# Altium project EIT_Teensybasedv1.PrjPcb (part 1 of 3)
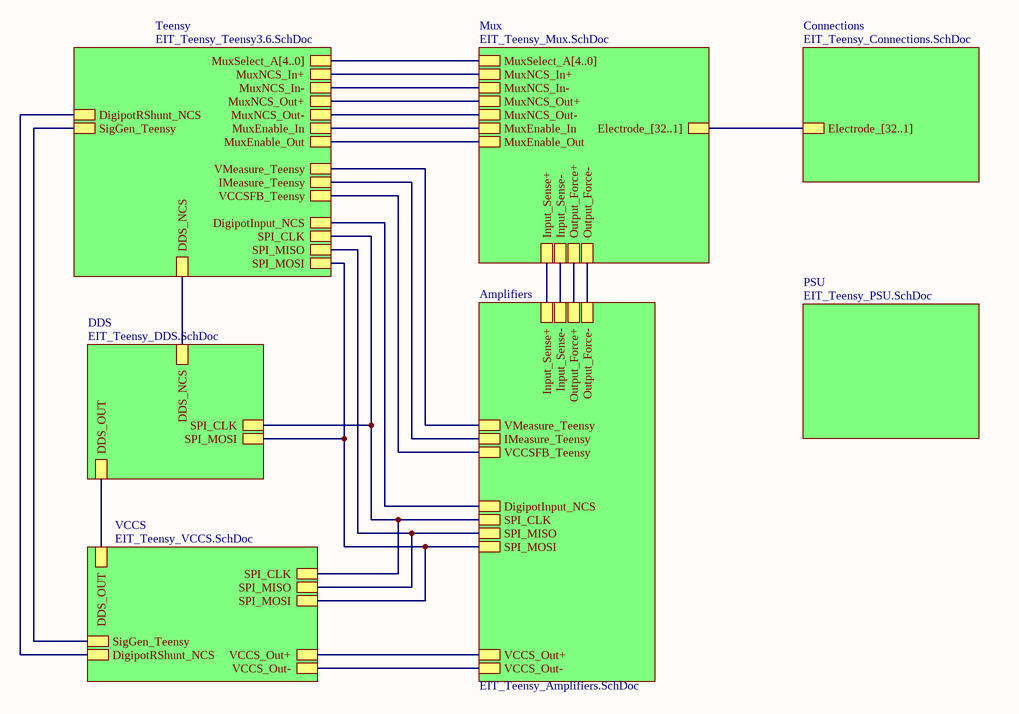
[diagram p0: EIT_Teensy.SchDoc]
Revision: 0.1; Title: EIT_Teensy
8 sheets, 118 parts. Net scope: hierarchical (ports join the sheet entries above them; power ports are global).
Board file: EIT_Teensy_PCBMain.PcbDoc
Sheets:
  EIT_Teensy.SchDoc
    Teensy = EIT_Teensy_Teensy3.6.SchDoc
    DDS = EIT_Teensy_DDS.SchDoc
    Connections = EIT_Teensy_Connections.SchDoc
    Mux = EIT_Teensy_Mux.SchDoc
    PSU = EIT_Teensy_PSU.SchDoc
    VCCS = EIT_Teensy_VCCS.SchDoc
    Amplifiers = EIT_Teensy_Amplifiers.SchDoc

## Sheet EIT_Teensy.SchDoc: EIT_Teensy
size A

### Sub-sheets
Amplifiers = EIT_Teensy_Amplifiers.SchDoc: IMeasure_Teensy, Input_Sense+, Input_Sense-, Output_Force+, Output_Force-, VCCS_Out+, VCCS_Out-, VMeasure_Teensy, VCCSFB_Teensy, DigipotInput_NCS, SPI_CLK, SPI_MISO, SPI_MOSI
Connections = EIT_Teensy_Connections.SchDoc: Electrode_[32..1]
DDS = EIT_Teensy_DDS.SchDoc: DDS_OUT, DDS_NCS, SPI_CLK, SPI_MOSI
Mux = EIT_Teensy_Mux.SchDoc: Electrode_[32..1], MuxSelect_A[4..0], Input_Sense+, Input_Sense-, Output_Force+, Output_Force-, MuxEnable_In, MuxEnable_Out, MuxNCS_In+, MuxNCS_In-, MuxNCS_Out+, MuxNCS_Out-
PSU = EIT_Teensy_PSU.SchDoc: no entries
Teensy = EIT_Teensy_Teensy3.6.SchDoc: MuxSelect_A[4..0], IMeasure_Teensy, VMeasure_Teensy, DDS_NCS, VCCSFB_Teensy, SigGen_Teensy, MuxEnable_In, MuxEnable_Out, DigipotRShunt_NCS, DigipotInput_NCS, SPI_CLK, SPI_MISO, SPI_MOSI, MuxNCS_In+, MuxNCS_In-, MuxNCS_Out+, MuxNCS_Out-
VCCS = EIT_Teensy_VCCS.SchDoc: DDS_OUT, VCCS_Out+, VCCS_Out-, SigGen_Teensy, DigipotRShunt_NCS, SPI_CLK, SPI_MISO, SPI_MOSI

### Nets
DDS_NCS: sheet Teensy/DDS_NCS, sheet DDS/DDS_NCS
DDS_OUT: sheet DDS/DDS_OUT, sheet VCCS/DDS_OUT
DigipotInput_NCS: sheet Teensy/DigipotInput_NCS, sheet Amplifiers/DigipotInput_NCS
DigipotRShunt_NCS: sheet Teensy/DigipotRShunt_NCS, sheet VCCS/DigipotRShunt_NCS
IMeasure_Teensy: sheet Teensy/IMeasure_Teensy, sheet Amplifiers/IMeasure_Teensy
Input_Sense+: sheet Mux/Input_Sense+, sheet Amplifiers/Input_Sense+
Input_Sense-: sheet Mux/Input_Sense-, sheet Amplifiers/Input_Sense-
MuxEnable_In: sheet Teensy/MuxEnable_In, sheet Mux/MuxEnable_In
MuxEnable_Out: sheet Teensy/MuxEnable_Out, sheet Mux/MuxEnable_Out
MuxNCS_In+: sheet Teensy/MuxNCS_In+, sheet Mux/MuxNCS_In+
MuxNCS_In-: sheet Teensy/MuxNCS_In-, sheet Mux/MuxNCS_In-
MuxNCS_Out+: sheet Teensy/MuxNCS_Out+, sheet Mux/MuxNCS_Out+
MuxNCS_Out-: sheet Teensy/MuxNCS_Out-, sheet Mux/MuxNCS_Out-
Output_Force+: sheet Mux/Output_Force+, sheet Amplifiers/Output_Force+
Output_Force-: sheet Mux/Output_Force-, sheet Amplifiers/Output_Force-
SigGen_Teensy: sheet Teensy/SigGen_Teensy, sheet VCCS/SigGen_Teensy
SPI_CLK: sheet Teensy/SPI_CLK, sheet DDS/SPI_CLK, sheet VCCS/SPI_CLK, sheet Amplifiers/SPI_CLK
SPI_MISO: sheet Teensy/SPI_MISO, sheet VCCS/SPI_MISO, sheet Amplifiers/SPI_MISO
SPI_MOSI: sheet Teensy/SPI_MOSI, sheet DDS/SPI_MOSI, sheet VCCS/SPI_MOSI, sheet Amplifiers/SPI_MOSI
VCCS_Out+: sheet VCCS/VCCS_Out+, sheet Amplifiers/VCCS_Out+
VCCS_Out-: sheet VCCS/VCCS_Out-, sheet Amplifiers/VCCS_Out-
VCCSFB_Teensy: sheet Teensy/VCCSFB_Teensy, sheet Amplifiers/VCCSFB_Teensy
VMeasure_Teensy: sheet Teensy/VMeasure_Teensy, sheet Amplifiers/VMeasure_Teensy

### Buses and harness runs
bus sheet Connections/Electrode_[32..1] = sheet Mux/Electrode_[32..1]
bus sheet Mux/MuxSelect_A[4..0] = sheet Teensy/MuxSelect_A[4..0]

## Sheet EIT_Teensy_Teensy3.6.SchDoc: EIT_Teensy
size A
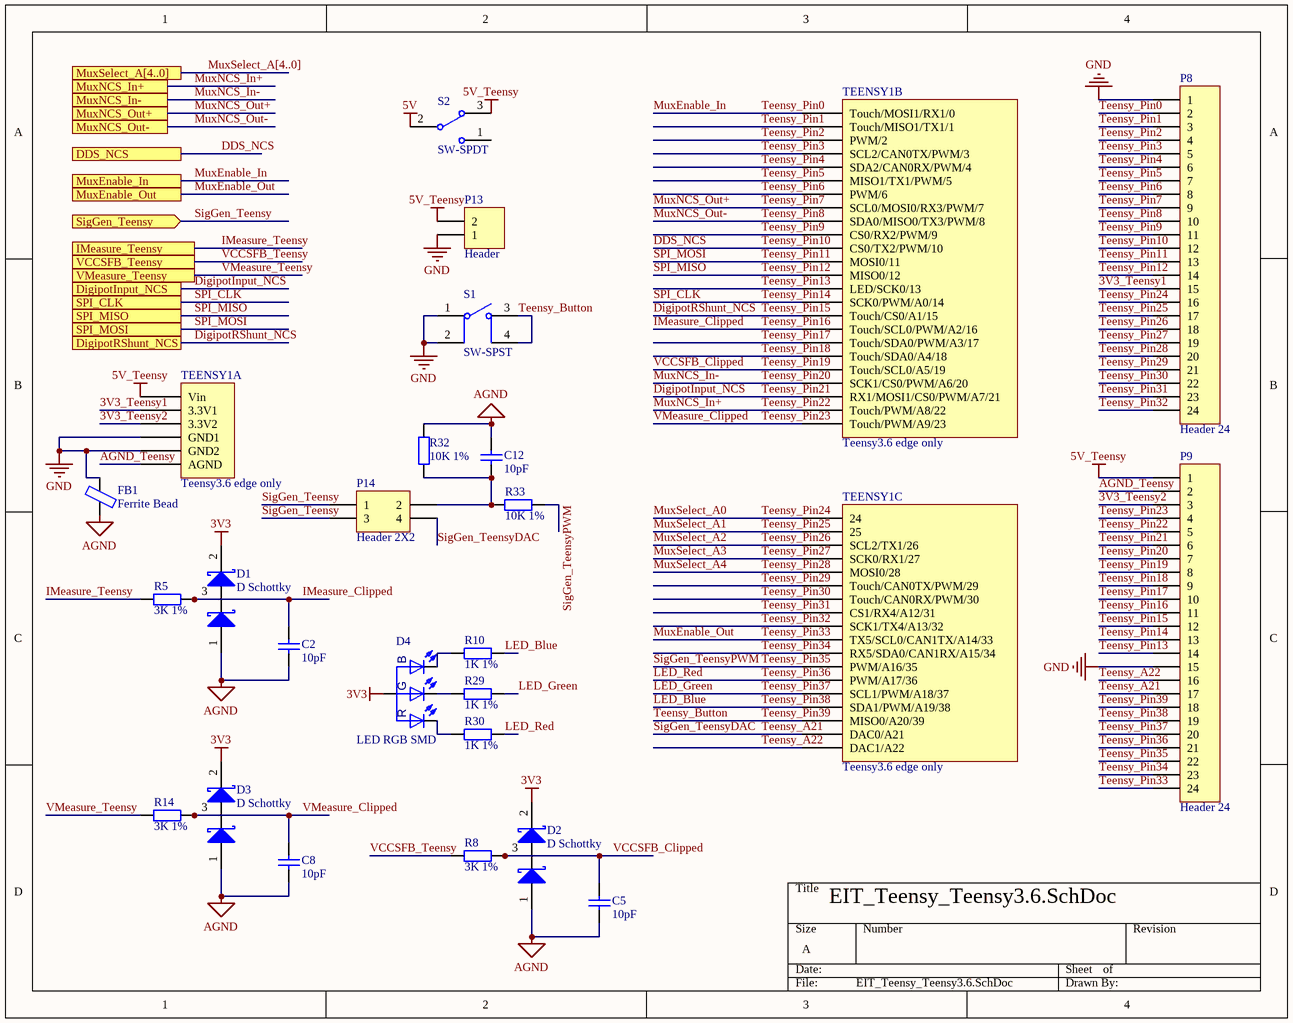
[diagram p1: EIT_Teensy_Teensy3.6.SchDoc]

### Parts
C2  10pF  [0603 CAP]
C5  10pF  [0603 CAP]
C8  10pF  [0603 CAP]
C12  10pF  [0603 CAP]
D1  D Schottky  [SOT-23_STM-M]
D2  D Schottky  [SOT-23_STM-M]
D3  D Schottky  [SOT-23_STM-M]
D4  LED RGB SMD  [LED_RGB]
FB1  Ferrite Bead  [0603 CAP]
P8  Header 24  [HDR1X24]
P9  Header 24  [HDR1X24]
P13  Header  [HEADER 2.54MM 2X1 MALE]
P14  Header 2X2  [HDR2X2 Male 2.54mm]
R5  3K 1%  [0603 RES]
R8  3K 1%  [0603 RES]
R10  1K 1%  [0603 RES]
R14  3K 1%  [0603 RES]
R29  1K 1%  [0603 RES]
R30  1K 1%  [0603 RES]
R32  10K 1%  [0603 RES]
R33  10K 1%  [0603 RES]
S1  SW-SPST  [Tactile Switch SMD MOM]
S2  SW-SPDT  [Switch Slide SPDT]
TEENSY1  Teensy3.6 edge only  [Teensy3.6-edgeonly]  (parts A,B,C of 3)

### Ports
DDS_NCS, DigipotInput_NCS, DigipotRShunt_NCS, IMeasure_Teensy, MuxEnable_In, MuxEnable_Out, MuxNCS_In+, MuxNCS_In-, MuxNCS_Out+, MuxNCS_Out-, MuxSelect_A[4..0], SigGen_Teensy (in), SPI_CLK, SPI_MISO, SPI_MOSI, VCCSFB_Teensy, VMeasure_Teensy

### Nets
3V3: D1.2(K) D2.2(K) D3.2(K) D4.4(CA)
5V: S2.2
5V_Teensy: P9.1 P13.2 S2.3 TEENSY1.VIN(Vin)
AGND: C2.2 C5.2 C8.2 C12.1 D1.1(A) D2.1(A) D3.1(A) FB1.1 R32.2
GND: FB1.2 P8.1 P9.15 P13.1 S1.1(COMMON) S1.2(NO) TEENSY1.GND1 TEENSY1.GND2
3V3_Teensy1: P8.15 TEENSY1.3.3V1
3V3_Teensy2: P9.3 TEENSY1.3.3V2
AGND_Teensy: P9.2 TEENSY1.AGND
DDS_NCS: P8.12 TEENSY1.10(CS0/TX2/PWM/10) ; port DDS_NCS  [also labelled Teensy_Pin10]
DigipotInput_NCS: P9.6 TEENSY1.21(RX1/MOSI1/CS0/PWM/A7/21) ; port DigipotInput_NCS  [also labelled Teensy_Pin21]
DigipotRShunt_NCS: P9.12 TEENSY1.15(Touch/CS0/A1/15) ; port DigipotRShunt_NCS  [also labelled Teensy_Pin15]
IMeasure_Clipped: C2.1 D1.3(C) P9.11 R5.2 TEENSY1.16(Touch/SCL0/PWM/A2/16)  [also labelled Teensy_Pin16]
IMeasure_Teensy: R5.1 ; port IMeasure_Teensy
LED_Blue: P9.19 R10.1 TEENSY1.38(SDA1/PWM/A19/38)  [also labelled Teensy_Pin38]
LED_Green: P9.20 R29.1 TEENSY1.37(SCL1/PWM/A18/37)  [also labelled Teensy_Pin37]
LED_Red: P9.21 R30.1 TEENSY1.36(PWM/A17/36)  [also labelled Teensy_Pin36]
MuxEnable_In: P8.2 TEENSY1.0(Touch/MOSI1/RX1/0) ; port MuxEnable_In  [also labelled Teensy_Pin0]
MuxEnable_Out: P9.24 TEENSY1.33(TX5/SCL0/CAN1TX/A14/33) ; port MuxEnable_Out  [also labelled Teensy_Pin33]
MuxNCS_In+: P9.5 TEENSY1.22(Touch/PWM/A8/22) ; port MuxNCS_In+  [also labelled Teensy_Pin22]
MuxNCS_In-: P9.7 TEENSY1.20(SCK1/CS0/PWM/A6/20) ; port MuxNCS_In-  [also labelled Teensy_Pin20]
MuxNCS_Out+: P8.9 TEENSY1.7(SCL0/MOSI0/RX3/PWM/7) ; port MuxNCS_Out+  [also labelled Teensy_Pin7]
MuxNCS_Out-: P8.10 TEENSY1.8(SDA0/MISO0/TX3/PWM/8) ; port MuxNCS_Out-  [also labelled Teensy_Pin8]
MuxSelect_A0: P8.16 TEENSY1.24  [also labelled Teensy_Pin24]
MuxSelect_A1: P8.17 TEENSY1.25  [also labelled Teensy_Pin25]
MuxSelect_A2: P8.18 TEENSY1.26(SCL2/TX1/26)  [also labelled Teensy_Pin26]
MuxSelect_A3: P8.19 TEENSY1.27(SCK0/RX1/27)  [also labelled Teensy_Pin27]
MuxSelect_A4: P8.20 TEENSY1.28(MOSI0/28)  [also labelled Teensy_Pin28]
SigGen_Teensy: P14.1 P14.3 ; port SigGen_Teensy
SigGen_TeensyDAC: P9.17 P14.4 TEENSY1.A21(DAC0/A21)  [also labelled Teensy_A21]
SigGen_TeensyPWM: P9.22 R33.1 TEENSY1.35(PWM/A16/35)  [also labelled Teensy_Pin35]
SPI_CLK: P9.13 TEENSY1.14(SCK0/PWM/A0/14) ; port SPI_CLK  [also labelled Teensy_Pin14]
SPI_MISO: P8.14 TEENSY1.12(MISO0/12) ; port SPI_MISO  [also labelled Teensy_Pin12]
SPI_MOSI: P8.13 TEENSY1.11(MOSI0/11) ; port SPI_MOSI  [also labelled Teensy_Pin11]
Teensy_A22: P9.16 TEENSY1.A22(DAC1/A22)
Teensy_Button: P9.18 S1.3(COMMON) S1.4(NO) TEENSY1.39(MISO0/A20/39)  [also labelled Teensy_Pin39]
Teensy_Pin1: P8.3 TEENSY1.1(Touch/MISO1/TX1/1)
Teensy_Pin2: P8.4 TEENSY1.2(PWM/2)
Teensy_Pin3: P8.5 TEENSY1.3(SCL2/CAN0TX/PWM/3)
Teensy_Pin4: P8.6 TEENSY1.4(SDA2/CAN0RX/PWM/4)
Teensy_Pin5: P8.7 TEENSY1.5(MISO1/TX1/PWM/5)
Teensy_Pin6: P8.8 TEENSY1.6(PWM/6)
Teensy_Pin9: P8.11 TEENSY1.9(CS0/RX2/PWM/9)
Teensy_Pin13: P9.14 TEENSY1.13(LED/SCK0/13)
Teensy_Pin17: P9.10 TEENSY1.17(Touch/SDA0/PWM/A3/17)
Teensy_Pin18: P9.9 TEENSY1.18(Touch/SDA0/A4/18)
Teensy_Pin19: C5.1 D2.3(C) P9.8 R8.2 TEENSY1.19(Touch/SCL0/A5/19)  [also labelled VCCSFB_Clipped]
Teensy_Pin23: C8.1 D3.3(C) P9.4 R14.2 TEENSY1.23(Touch/PWM/A9/23)  [also labelled VMeasure_Clipped]
Teensy_Pin29: P8.21 TEENSY1.29(Touch/CAN0TX/PWM/29)
Teensy_Pin30: P8.22 TEENSY1.30(Touch/CAN0RX/PWM/30)
Teensy_Pin31: P8.23 TEENSY1.31(CS1/RX4/A12/31)
Teensy_Pin32: P8.24 TEENSY1.32(SCK1/TX4/A13/32)
Teensy_Pin34: P9.23 TEENSY1.34(RX5/SDA0/CAN1RX/A15/34)
VCCSFB_Teensy: R8.1 ; port VCCSFB_Teensy
VMeasure_Teensy: R14.1 ; port VMeasure_Teensy
NetC12_2: C12.2 P14.2 R32.1 R33.2
NetD4_1: D4.1(R) R30.2
NetD4_2: D4.2(G) R29.2
NetD4_3: D4.3(B) R10.2

Not connected (* = marked no-connect by the designer): S2 1

### Buses and harness runs
bus MuxSelect_A[4..0] = port MuxSelect_A[4..0]

### Library data of the parts
C2 C5 C8 C12 = Cap 0603 10pF 5% 100V: CAP, MLCC, C0G/NP0, 10PF, 50V,0603, REEL; Product Range:YAGEO - CC Series; Capacitance:10pF; Capacitance Tolerance:± 5%; Dielectric Characteristic:C0G / NP0; Voltage Rating:50V; Ceramic Capacitor Case:0603 [1608 Metric]; Operating Temperature Min:-55°C; Operating Temperature Max:125°C; Packaging:Tape & Reel; MSL:MSL 1 - Unlimited; SVHC:No SVHC (16-Dec-2013); Capacitance Tolerance ±:± 5%; Capacitor Case Style:0603 [1608 Metric]; Capacitor Terminals:SMD; No. of Pins:2; Operating Temperature Range:-55°C to +125°C; Reel Quantity:4000; Temperature Coefficient:0ppm/°C ± 30ppm/°C; Terminal Type:Surfa; Manufacturer: Yageo; Manufacturer Part Number: CC0603JRNPO9BN100; Dielectric: C0G; Insulation Resistance: 100GR; Supplier 1: Digi-Key; RoHS: Yes; Category: Ceramic Capacitors; Stock 1: 559632; Pricing 1: 1=0.10000, 10=0.04100, 50=0.02220, 100=0.01810, 500=0.01296, 1000=0.01018 (USD); Mount: Surface Mount; Case/Package: 0603; Number of Pins: 2; Case Code (Metric): 1608; Case Code (Imperial): 0603; Min Operating Temperature: -55°C; Max Operating Temperature: 125°C; Capacitance: 10pF; Tolerance: 5%; Voltage Rating: 50V; Voltage Rating (DC): 50V; Packaging: Tape and Reel; Package Quantity: 1; Termination: SMD/SMT; Resistor Type: Ceramic; Voltage: 50V; Temperature Coefficient: 30ppm/°C; Series: CC; Length: 1.6mm; Width: 0.031inch; Height: 0.8mm; Thickness: 0.035inch; Depth: 0.8mm; Radiation Hardening: No; REACH SVHC: No SVHC; Lead Free: Lead Free; RoHS Compliant: Yes; ComponentLink1URL: https://datasheet.ciiva.com/144/mlccorderingcode-144651.pdf?src-supplier=Digi-Key; ComponentLink1Description: https://datasheet.ciiva.com/144/mlccorderingcode-144651.pdf?src-supplier=Digi-Key; ComponentLink2URL: https://datasheet.ciiva.com/5789/1734582-5789616.pdf?src-supplier=Farnell; ComponentLink2Description: https://datasheet.ciiva.com/5789/1734582-5789616.pdf?src-supplier=Farnell; ComponentLink3URL: https://datasheet.ciiva.com/11786/0900766b8079c870-11786407.pdf?src-supplier=RSComponents; ComponentLink3Description: https://datasheet.ciiva.com/11786/0900766b8079c870-11786407.pdf?src-supplier=RSComponents; ComponentLink4URL: https://datasheet.ciiva.com/26862/getdatasheetpartid-403524-26862758.pdf?src-supplier=Verical; ComponentLink4Description: https://datasheet.ciiva.com/26862/getdatasheetpartid-403524-26862758.pdf?src-supplier=Verical; ComponentLink5URL: https://datasheet.ciiva.com/144/mlccorderingcode-144649.pdf?src-supplier=Digi-Key; ComponentLink5Description: https://datasheet.ciiva.com/144/mlccorderingcode-144649.pdf?src-supplier=Digi-Key; ComponentLink6URL: https://datasheet.ciiva.com/144/mlccorderingcode-144650.pdf?src-supplier=Digi-Key; ComponentLink6Description: https://datasheet.ciiva.com/144/mlccorderingcode-144650.pdf?src-supplier=Digi-Key; ComponentLink7URL: https://datasheet.ciiva.com/5425/upy-gp-np0-16v-to-50v-8-5425564.pdf?src-supplier=Mouser; ComponentLink7Description: https://datasheet.ciiva.com/5425/upy-gp-np0-16v-to-50v-8-5425564.pdf?src-supplier=Mouser; ComponentLink8URL: https://datasheet.ciiva.com/16625/upy-gp-np0-16v-to-50v-8-16625514.pdf?src-supplier=Avnet+Europe; ComponentLink8Description: https://datasheet.ciiva.com/16625/upy-gp-np0-16v-to-50v-8-16625514.pdf?src-supplier=Avnet+Europe; ComponentLink9URL: https://datasheet.ciiva.com/7978/1132289-7978126.pdf?src-supplier=Element14; ComponentLink9Description: https://datasheet.ciiva.com/7978/1132289-7978126.pdf?src-supplier=Element14; ComponentLink10URL: https://datasheet.ciiva.com/8033/1734582-8033706.pdf?src-supplier=Element14; ComponentLink10Description: https://datasheet.ciiva.com/8033/1734582-8033706.pdf?src-supplier=Element14; ComponentLink11URL: https://datasheet.ciiva.com/8033/1734582-8033710.pdf?src-supplier=Element14; ComponentLink11Description: https://datasheet.ciiva.com/8033/1734582-8033710.pdf?src-supplier=Element14; ComponentLink12URL: https://datasheet.ciiva.com/46430/1835847-46430150.pdf?src-supplier=Element14; ComponentLink12Description: https://datasheet.ciiva.com/46430/1835847-46430150.pdf?src-supplier=Element14; Supplier Part Number 1: 311-1058-1-ND
D1-D3 = Diode Array Schottky BAT54S SOT23-3: Rectifier Diode Small Signal Schottky 40V 0.3A 5ns 3-Pin SOT-23 T/R; Manufacturer: STMicroelectronics; Manufacturer Part Number: BAT54SFILM; Average Rectified Current: 300mA; Element Configuration: Single; Forward Voltage: 900mV; Max Forward Surge Current (Ifsm): 1A; Max Reverse Current: 100uA; Max Reverse Leakage Current: 1uA; Voltage Rating (DC): 30V; Supplier 1: Digi-Key; RoHS: Yes; Category: Rectifier Diodes; Stock 1: 23811; Pricing 1: 1=0.25000, 10=0.20400, 100=0.10820, 500=0.07116, 1000=0.04838 (USD); Mount: Surface Mount; Case/Package: SOT-23; Weight: 0.1lb; Min Operating Temperature: -40°C; Max Operating Temperature: 150°C; Packaging: Tape and Reel; Forward Current: 300mA; Max Repetitive Reverse Voltage (Vrrm): 40V; Package Quantity: 3000; Max Reverse Voltage (DC): 40V; RoHS Compliant: Yes; ComponentLink1URL: https://datasheet.ciiva.com/1200/cd00001322-1200682.pdf?src-supplier=Farnell; ComponentLink1Description: https://datasheet.ciiva.com/1200/cd00001322-1200682.pdf?src-supplier=Farnell; ComponentLink2URL: https://datasheet.ciiva.com/1200/1689724-1200683.pdf?src-supplier=Farnell; ComponentLink2Description: https://datasheet.ciiva.com/1200/1689724-1200683.pdf?src-supplier=Farnell; ComponentLink3URL: https://datasheet.ciiva.com/905/cd00001322-905881.pdf?src-supplier=Digi-Key; ComponentLink3Description: https://datasheet.ciiva.com/905/cd00001322-905881.pdf?src-supplier=Digi-Key; ComponentLink4URL: https://datasheet.ciiva.com/905/cd00001322-905882.pdf?src-supplier=Digi-Key; ComponentLink4Description: https://datasheet.ciiva.com/905/cd00001322-905882.pdf?src-supplier=Digi-Key; ComponentLink5URL: https://datasheet.ciiva.com/905/cd00001322-905883.pdf?src-supplier=Digi-Key; ComponentLink5Description: https://datasheet.ciiva.com/905/cd00001322-905883.pdf?src-supplier=Digi-Key; Number of Pins: 3; Max Surge Current: 1A; Recovery Time: 5ns; Reverse Recovery Time: 5ns; Peak Non-Repetitive Surge Current: 1A; Termination: SMD/SMT; Current Rating: 300mA; Length: 2.9mm; Width: 3.05mm; Height: 0.95mm; Radiation Hardening: No; REACH SVHC: No SVHC; Lead Free: Lead Free; ComponentLink6URL: https://datasheet.ciiva.com/14168/cd00001322-14168028.pdf?src-supplier=Distrelec; ComponentLink6Description: https://datasheet.ciiva.com/14168/cd00001322-14168028.pdf?src-supplier=Distrelec; Supplier Part Number 1: 497-2522-1-ND
D4 = LED RGB SMD: LED RGB DIFFUSED SMD; Manufacturer: Wurth Electronics; Manufacturer Part Number: 150066M153000; Color: Blue,Green,Red; Lens Style: Flat; Element Configuration: Common Anode; Luminous Intensity: 180mcd; Forward Voltage: 3.3V; Test Current: 20mA; Viewing Angle: 120°; Dominant Wavelength: 470nm; Lens Size: 1.6mm; Supplier 1: Digi-Key; RoHS: Yes; Category: LEDs; Stock 1: 12367; Pricing 1: 1=0.51000, 50=0.41500, 100=0.29800, 500=0.27200 (USD); Mount: Surface Mount; Case/Package: 0606; Case Code (Imperial): 0606; Case Code (Metric): 1616; Packaging: Tape and Reel; Lens Transparency: Diffused; Length: 1.6mm; Width: 1.6mm; Height: 0.5mm; RoHS Compliant: Yes; ComponentLink1URL: http://www.farnell.com/datasheets/2301702.pdf?src-supplier=Farnell; ComponentLink1Description: http://www.farnell.com/datasheets/2301702.pdf?src-supplier=Farnell; ComponentLink2URL: https://katalog.we-online.de/led/datasheet/150066M153000.pdf?src-supplier=Digi-Key; ComponentLink2Description: https://katalog.we-online.de/led/datasheet/150066M153000.pdf?src-supplier=Digi-Key; ComponentLink3URL: http://www.farnell.com/datasheets/2301702.pdf?src-supplier=Newark; ComponentLink3Description: http://www.farnell.com/datasheets/2301702.pdf?src-supplier=Newark; ComponentLink4URL: http://www.farnell.com/datasheets/2301702.pdf?src-supplier=Element14; ComponentLink4Description: http://www.farnell.com/datasheets/2301702.pdf?src-supplier=Element14; Supplier Part Number 1: 732-11390-1-ND
FB1 = Ferrite Bead 0603 600R: WURTH ELEKTRONIK - 742792651 - Ferrite Bead, 0603 [1608 Metric], 600 ohm, 1 A, WE-CBF Series, 0.2 ohm, &#177; 25%; Manufacturer: Wurth Electronics; Code_IEC: 1005; Inductance: 0.36H; Resistance: 200mR; Current Rating: 1A; Impedance: 600R; Number of Lines: 1; Test Frequency: 100MHz; PackageDescription: Chip Inductor; Code_JEITA: 0402; Supplier 1: Digi-Key; Manufacturer Part Number: 742792651; RoHS: Yes; Category: Ferrite Beads and Chips; Stock 1: 222780; Pricing 1: 1=0.17000, 50=0.16800, 100=0.15500, 500=0.14800, 1000=0.14100, 2000=0.13400 (USD); Mount: Surface Mount; Case/Package: SMD/SMT; Core Material: Ferrite; Weight: 0.000141oz; Case Code (Metric): 1608; Case Code (Imperial): 0603; Material: Ferrite; Min Operating Temperature: -55°C; Max Operating Temperature: 125°C; Tolerance: 25%; Package Quantity: 1; Packaging: Tape and Reel; Max Current Rating: 1A; DC Resistance (DCR): 200mR; Max DC Current: 1A; Termination: SMD/SMT; Series: WE-CBF; Length: 1.6mm; Width: 0.8mm; Height: 0.8mm; Depth: 0.8mm; REACH SVHC: Unknown; Lead Free: Lead Free; RoHS Compliant: Yes; ComponentLink1URL: https://datasheet.ciiva.com/1013/742792651-1013527.pdf?src-supplier=Digi-Key; ComponentLink1Description: https://datasheet.ciiva.com/1013/742792651-1013527.pdf?src-supplier=Digi-Key; ComponentLink2URL: https://datasheet.ciiva.com/1475/1705833-1475349.pdf?src-supplier=Farnell; ComponentLink2Description: https://datasheet.ciiva.com/1475/1705833-1475349.pdf?src-supplier=Farnell; ComponentLink3URL: https://datasheet.ciiva.com/4940/742792651-72243-4940492.pdf?src-supplier=Mouser; ComponentLink3Description: https://datasheet.ciiva.com/4940/742792651-72243-4940492.pdf?src-supplier=Mouser; ComponentLink4URL: https://datasheet.ciiva.com/11803/0900766b80d2e079-11803680.pdf?src-supplier=RSComponents; ComponentLink4Description: https://datasheet.ciiva.com/11803/0900766b80d2e079-11803680.pdf?src-supplier=RSComponents; ComponentLink5URL: https://datasheet.ciiva.com/1013/742792651-1013528.pdf?src-supplier=Digi-Key; ComponentLink5Description: https://datasheet.ciiva.com/1013/742792651-1013528.pdf?src-supplier=Digi-Key; ComponentLink6URL: https://datasheet.ciiva.com/1013/742792651-1013529.pdf?src-supplier=Digi-Key; ComponentLink6Description: https://datasheet.ciiva.com/1013/742792651-1013529.pdf?src-supplier=Digi-Key; ComponentLink7URL: https://datasheet.ciiva.com/22711/1705833-22711420.pdf?src-supplier=Element14; ComponentLink7Description: https://datasheet.ciiva.com/22711/1705833-22711420.pdf?src-supplier=Element14; Supplier Part Number 1: 732-1593-1-ND
P8 P9 = Header 24x1 Male: CONN HEADER .100 SNGL STR 24POS; Manufacturer: Sullins; Manufacturer Part Number: PRPC024SFAN-RC; Number of Positions: 24; Connector Type: Male Pin; Pitch: 0.1inch; Supplier 1: Digi-Key; RoHS: Yes; Category: Connectors; Stock 1: 248; Pricing 1: 1=0.68000, 10=0.63500, 25=0.57160, 50=0.50800, 100=0.48690, 250=0.44452, 500=0.42336 (USD); Mount: Through Hole; Color: Black; Contact Plating: Gold; Package Quantity: 1; Number of Rows: 1; Packaging: Bulk; Termination: Solder; Series: -; Contact Type: Male Pin; Contact Mating Length: 0.318inch; RoHS Compliant: Yes; ComponentLink1URL: https://datasheet.ciiva.com/741/xrxczzzsxxn-rc-st-11635-b-741341.pdf?src-supplier=Digi-Key; ComponentLink1Description: https://datasheet.ciiva.com/741/xrxczzzsxxn-rc-st-11635-b-741341.pdf?src-supplier=Digi-Key; Supplier Part Number 1: S1211EC-24-ND
P13 = Header 2x1 2.54mm T/H Male: CONN HEADER VERT 2POS 2.54MM; Manufacturer: Sullins; Manufacturer Part Number: PRPC002SAAN-RC; Number of Positions: 2; Connector Type: Male Pin; Pitch: 0.1inch; Supplier 1: Digi-Key; RoHS: Yes; Category: Connectors; Stock 1: 34676; Pricing 1: 1=0.08000, 10=0.07300, 25=0.05400, 50=0.04640, 100=0.04490, 250=0.03872, 500=0.03716 (USD); Mount: Through Hole; Color: Black; Contact Plating: Gold; Package Quantity: 1; Number of Rows: 1; Termination: Solder; Packaging: Bulk; Contact Mating Length: 0.23inch; ComponentLink1URL: https://datasheet.ciiva.com/741/xrxczzzsxxn-rc-st-11635-b-741243.pdf?src-supplier=Digi-Key; ComponentLink1Description: https://datasheet.ciiva.com/741/xrxczzzsxxn-rc-st-11635-b-741243.pdf?src-supplier=Digi-Key; Supplier Part Number 1: S1011EC-02-ND
P14 = Header 2X2 2.54mm Male: Header, 2-Pin, Dual row
R5 R8 R14 = Res 0603 3K 1%: Res Thick Film 0603 3K Ohm 1% 0.1W(1/10W) ±100ppm/C Pad SMD T/R; Manufacturer: Yageo; Manufacturer Part Number: RC0603FR-073KL; Resistance: 3kR; Power Rating: 100mW; Voltage Rating: 50V; Temperature Coefficient: 100ppm/°C; Supplier 1: Digi-Key; RoHS: Yes; Category: Chip SMD Resistors; Stock 1: 1025416; Pricing 1: 1=0.10000, 10=0.02400, 100=0.00970, 1000=0.00436, 2500=0.00378 (USD); Case/Package: 0603; Number of Pins: 2; Case Code (Imperial): 0603; Case Code (Metric): 1608; Size Code: 0603; Min Operating Temperature: -55°C; Max Operating Temperature: 155°C; Packaging: Tape and Reel; Tolerance: 1%; Voltage Rating (DC): 50V; Termination: SMD/SMT; Resistor Type: Thick Film; Features: Moisture Resistant; Series: RC; Max Power Dissipation: 100mW; Number of Terminations: 2; Resistance Tolerance: 1%; Construction: Rectangular; Length: 1.6mm; Width: 800um; Depth: 0.8mm; REACH SVHC: No SVHC; Lead Free: Lead Free; RoHS Compliant: Yes; Military Standard: Not; ComponentLink1URL: http://www.mouser.com/ds/2/447/RC0603-272842.pdf?src-supplier=Mouser; ComponentLink1Description: http://www.mouser.com/ds/2/447/RC0603-272842.pdf?src-supplier=Mouser; ComponentLink2URL: http://www.farnell.com/datasheets/2167052.pdf?src-supplier=Farnell; ComponentLink2Description: http://www.farnell.com/datasheets/2167052.pdf?src-supplier=Farnell; ComponentLink3URL: https://www.verical.com/server-webapp/html/getDatasheet?partID=135099&src-supplier=Verical; ComponentLink3Description: https://www.verical.com/server-webapp/html/getDatasheet?partID=135099&src-supplier=Verical; ComponentLink4URL: http://components.arrow.com/part/dataview/0323_00200942?src-supplier=Arrow+Europe; ComponentLink4Description: http://components.arrow.com/part/dataview/0323_00200942?src-supplier=Arrow+Europe; Supplier Part Number 1: 311-3.00KHRCT-ND; ComponentLink5URL: http://www.yageo.com/documents/recent/PYu-RC_Group_51_RoHS_L_9.pdf?src-supplier=Digi-Key; ComponentLink5Description: http://www.yageo.com/documents/recent/PYu-RC_Group_51_RoHS_L_9.pdf?src-supplier=Digi-Key; ComponentLink6URL: http://www.yageo.com/documents/recent/PYu-RC_Group_51_RoHS_L_10.pdf?src-supplier=Digi-Key; ComponentLink6Description: http://www.yageo.com/documents/recent/PYu-RC_Group_51_RoHS_L_10.pdf?src-supplier=Digi-Key; ComponentLink7URL: http://www.farnell.com/datasheets/1868787.pdf?src-supplier=Newark; ComponentLink7Description: http://www.farnell.com/datasheets/1868787.pdf?src-supplier=Newark; ComponentLink8URL: http://www.yageo.com/documents/recent/PYu-RC0603_51_RoHS_L_7.pdf?src-supplier=Future+Electronics; ComponentLink8Description: http://www.yageo.com/documents/recent/PYu-RC0603_51_RoHS_L_7.pdf?src-supplier=Future+Electronics; ComponentLink9URL: http://www.farnell.com/datasheets/2167052.pdf?src-supplier=Element14; ComponentLink9Description: http://www.farnell.com/datasheets/2167052.pdf?src-supplier=Element14
R10 R29 R30 = Res 0603 1K 1%: RES SMD 1K OHM 1% 1/10W 0603; Manufacturer: Yageo; Manufacturer Part Number: RC0603FR-071KL; Power Rating: 100mW; Resistance: 1kR; Voltage Rating: 50V; Temperature Coefficient: 100ppm/°C; Supplier 1: Digi-Key; RoHS: Yes; Category: Chip SMD Resistors; Stock 1: 23578085; Pricing 1: 1=0.10000, 10=0.02400, 100=0.00970, 1000=0.00436, 2500=0.00378 (USD); Case/Package: 0603; Case Code (Imperial): 0603; Case Code (Metric): 1608; Size Code: 0603; Contact Plating: Tin,Matte; Min Operating Temperature: -55°C; Max Operating Temperature: 155°C; Tolerance: 1%; Packaging: Tape and Reel; Termination: SMD/SMT; Resistor Type: Thick Film; Features: Moisture Resistant; Series: RC; Max Power Dissipation: 100mW; Number of Terminations: 2; Resistance Tolerance: 1%; Construction: Rectangular; Technology: THICK FILM; Length: 1.6mm; Height: 0.45mm; Depth: 0.8mm; Radiation Hardening: No; REACH SVHC: No SVHC; Military Standard: Not; Lead Free: Lead Free; RoHS Compliant: Yes; ComponentLink1URL: https://datasheet.ciiva.com/8896/pyu-rc0603-51-rohs-l-4-8896106.pdf?src-supplier=Avnet; ComponentLink1Description: https://datasheet.ciiva.com/8896/pyu-rc0603-51-rohs-l-4-8896106.pdf?src-supplier=Avnet; Supplier Part Number 1: 311-1.00KHRCT-ND
R32 R33 = Res 0603 10K 1%: Res General Purpose Thick Film 0603 10K Ohm 1% 1/10W ±100ppm/°C Molded SMD Paper T/R; Manufacturer: Yageo; Manufacturer Part Number: RC0603FR-0710KL; Voltage Rating: 75V; Resistance: 10kR; Power Rating: 100mW; Voltage Rating (DC): 50V; Supplier 1: Digi-Key; RoHS: Yes; Category: Chip SMD Resistors; Stock 1: 18430741; Pricing 1: 1=0.10000, 10=0.02400, 100=0.00970, 1000=0.00436, 2500=0.00378 (USD); Case/Package: 0603; Number of Pins: 2; Case Code (Imperial): 0603; Case Code (Metric): 1608; Size Code: 0603; Weight: 7.1E-05oz; Min Operating Temperature: -55°C; Max Operating Temperature: 155°C; Packaging: Tape and Reel; Tolerance: 1%; Termination: SMD/SMT; Resistor Type: Thick Film; Temperature Coefficient: 100ppm/°C; Features: Moisture Resistant; Series: RC; Max Power Dissipation: 100mW; Number of Terminations: 2; Resistance Tolerance: 1%; Construction: Rectangular; Length: 1.6mm; Width: 0.8mm; Height: 0.45mm; Depth: 0.8mm; Lead Pitch: 0.3mm; REACH SVHC: Unknown; Military Standard: Not; Lead Free: Lead Free; RoHS Compliant: Yes; ComponentLink1URL: https://datasheet.ciiva.com/15189/getdatasheetpartid-409289-15189591.pdf?src-supplier=Verical; ComponentLink1Description: https://datasheet.ciiva.com/15189/getdatasheetpartid-409289-15189591.pdf?src-supplier=Verical; ComponentLink2URL: https://datasheet.ciiva.com/7660/38590-7660789.pdf?src-supplier=Element14; ComponentLink2Description: https://datasheet.ciiva.com/7660/38590-7660789.pdf?src-supplier=Element14; ComponentLink3URL: https://datasheet.ciiva.com/7746/1738695-7746239.pdf?src-supplier=Element14; ComponentLink3Description: https://datasheet.ciiva.com/7746/1738695-7746239.pdf?src-supplier=Element14; ComponentLink4URL: https://datasheet.ciiva.com/7983/443971-7983596.pdf?src-supplier=Element14; ComponentLink4Description: https://datasheet.ciiva.com/7983/443971-7983596.pdf?src-supplier=Element14; ComponentLink5URL: https://datasheet.ciiva.com/22747/443971-22747519.pdf?src-supplier=Element14; ComponentLink5Description: https://datasheet.ciiva.com/22747/443971-22747519.pdf?src-supplier=Element14; ComponentLink6URL: https://datasheet.ciiva.com/46440/1868787-46440891.pdf?src-supplier=Element14; ComponentLink6Description: https://datasheet.ciiva.com/46440/1868787-46440891.pdf?src-supplier=Element14; Supplier Part Number 1: 311-10.0KHRCT-ND
S1 = Switch Tactile SMD MOM-NO 50mA: Switch Tactile N.O. SPST Round Button Gull Wing 0.05A 12VDC 2.55N SMD T/R; Manufacturer: E-Switch; Manufacturer Part Number: TL3305BF260QG; Mechanical Life: 200000Cycles; Illumination Type: Non-Illuminated; Operating Force: 260gf; Switch Travel: 0.2mm; Switch Function: Off-Mom; Actuator Type: Standard; Supplier 1: Digi-Key; RoHS: Yes; Category: Tactile Switches; Stock 1: 96859; Pricing 1: 1=0.20000, 10=0.19600, 25=0.18600, 100=0.16920, 250=0.15904, 500=0.14550 (USD); Mount: Surface Mount; Min Operating Temperature: -20°C; Max Operating Temperature: 70°C; Packaging: Tape and Reel; Termination: Gull Wing; Throw Configuration: SPST; Lead Free: Lead Free; RoHS Compliant: Yes; ComponentLink1URL: http://www.farnell.com/datasheets/2554191.pdf?src-supplier=Farnell; ComponentLink1Description: http://www.farnell.com/datasheets/2554191.pdf?src-supplier=Farnell; ComponentLink2URL: https://www.e-switch.com/system/asset/product_line/data_sheet/213/TL3305.pdf?src-supplier=Digi-Key; ComponentLink2Description: https://www.e-switch.com/system/asset/product_line/data_sheet/213/TL3305.pdf?src-supplier=Digi-Key; ComponentLink3URL: http://spec_sheets.e-switch.com/specs/P010472.pdf?src-supplier=Digi-Key; ComponentLink3Description: http://spec_sheets.e-switch.com/specs/P010472.pdf?src-supplier=Digi-Key; ComponentLink4URL: http://www.farnell.com/datasheets/2554191.pdf?src-supplier=Newark; ComponentLink4Description: http://www.farnell.com/datasheets/2554191.pdf?src-supplier=Newark; Supplier Part Number 1: EG5354CT-ND
S2 = Switch Slide SPDT T/H: SWITCH SLIDE SPDT 300MA 125V; Manufacturer: TE Connectivity Alcoswitch; Manufacturer Part Number: 1825255-1; Actuator Material: Polyoxymethylene,Acetal; Mechanical Life: 15000Cycles; Contact Resistance: 30mR; Switch Function: On-On; Actuator Type: Standard; Operating Force: 600gf; Contact Style: Shorting; Number of Positions: 2; Switch Travel: 4mm; PCB Mount Retention: With; Actuator Length: 4.5mm; Tail Length: 3.51mm; ComponentLink1Description: Manufacturer Link; ComponentLink1URL: http://www.apem.com; Supplier 1: Digi-Key; RoHS: Yes; Category: Slide Switches; Stock 1: 3432; Pricing 1: 1=0.85000, 10=0.82000, 25=0.76640, 100=0.66540, 250=0.60552, 500=0.56136, 1000=0.52037, 2500=0.47306, 5000=0.44524 (USD); Mount: Through Hole; Contact Material: Copper Alloy; Contact Plating: Silver; Min Operating Temperature: -20°C; Max Operating Temperature: 85°C; Throw Configuration: SPDT; Voltage Rating (AC): 125V; Max Voltage Rating (AC): 125V; Package Quantity: 560; Termination: PC Pin; Electrical Life: 15000Cycles; Orientation: Vertical; Contact Current Rating: 300mA; Series: MHS; Packaging: Tray; Max Current Rating: 300mA; Current Rating: 300mA; Type: Switch; Length: 0.5906inch; Width: 6.2mm; Depth: 6.7mm; Radiation Hardening: No; Lead Free: Lead Free; Flammability Rating: UL94 HB; REACH SVHC: Unknown; ELV: Compliant; RoHS Compliant: Yes; ComponentLink2URL: https://datasheet.ciiva.com/16312/1825255-1-16312669.pdf?src-supplier=Future+Electronics; ComponentLink2Description: https://datasheet.ciiva.com/16312/1825255-1-16312669.pdf?src-supplier=Future+Electronics; ComponentLink3URL: https://datasheet.ciiva.com/26326/701730-da-01-en-schiebeschalter-mhs12204-26326741.pdf?src-supplier=Conrad; ComponentLink3Description: https://datasheet.ciiva.com/26326/701730-da-01-en-schiebeschalter-mhs12204-26326741.pdf?src-supplier=Conrad; ComponentLink4URL: https://datasheet.ciiva.com/30160/eng-cs-1308111-1-switches-core-program-catalog-03082-30160106.pdf?src-supplier=Onlinecomponents.com; ComponentLink4Description: https://datasheet.ciiva.com/30160/eng-cs-1308111-1-switches-core-program-catalog-03082-30160106.pdf?src-supplier=Onlinecomponents.com; ComponentLink5URL: https://datasheet.ciiva.com/1532/921681-1532372.pdf?src-supplier=Element14; ComponentLink5Description: https://datasheet.ciiva.com/1532/921681-1532372.pdf?src-supplier=Element14; Supplier Part Number 1: 450-1567-ND

## Sheet EIT_Teensy_DDS.SchDoc: EIT_Teensy
size A
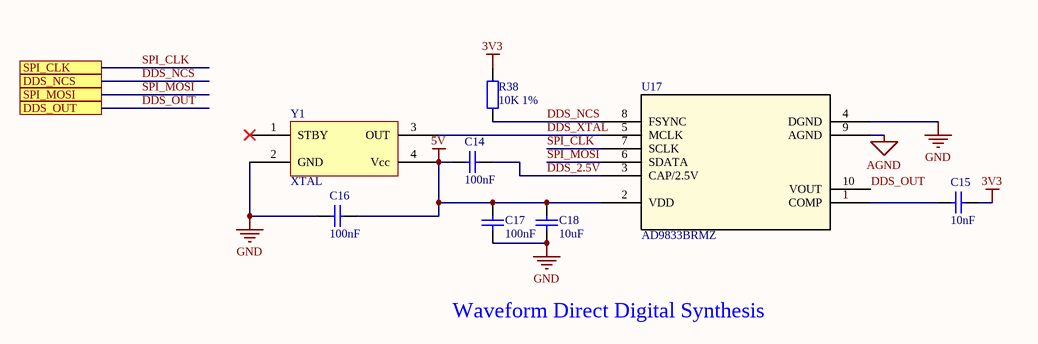
[diagram p2: EIT_Teensy_DDS.SchDoc]

### Parts
C14  100nF  [0603 CAP]
C15  10nF  [0603 CAP]
C16  100nF  [0603 CAP]
C17  100nF  [0603 CAP]
C18  10uF  [0603 CAP]
R38  10K 1%  [0603 RES]
U17  AD9833BRMZ  [RM_10_ADI]
Y1  XTAL  [XTAL SMD]

### Ports
DDS_NCS, DDS_OUT, SPI_CLK, SPI_MOSI

### Nets
3V3: C15.2 R38.2
5V: C14.1 C16.1 C17.2 C18.2 U17.2(VDD) Y1.4(Vcc)
AGND: U17.9(AGND)
GND: C16.2 C17.1 C18.1 U17.4(DGND) Y1.2(GND)
DDS_2.5V: C14.2 U17.3(CAP/2.5V)
DDS_NCS: R38.1 U17.8(FSYNC) ; port DDS_NCS
DDS_OUT: U17.10(VOUT) ; port DDS_OUT
DDS_XTAL: U17.5(MCLK) Y1.3(OUT)
SPI_CLK: U17.7(SCLK) ; port SPI_CLK
SPI_MOSI: U17.6(SDATA) ; port SPI_MOSI
NetC15_1: C15.1 U17.1(COMP)

Not connected (* = marked no-connect by the designer): Y1 1(STBY)*

### Notes on the sheet
- Waveform Direct Digital Synthesis

### Library data of the parts
C14 C16 C17 = Cap 0603 100nF 10% 50V: Multi Layer Ceramic Capacitor (MLCC) / Cap Ceramic 0.1uF 50V X7R 10% Pad SMD 0603 125¡ãC T/R; Manufacturer: Samsung; Manufacturer Part Number: CL10B104KB8NNNC; Supplier 1: Digi-Key; RoHS: Yes; Category: Ceramic Capacitors; Stock 1: 16186368; Pricing 1: 1=0.10000, 10=0.03000, 50=0.01620, 100=0.01330, 500=0.00950, 1000=0.00746 (USD); Mount: Surface Mount; Case/Package: 0603; Case Code (Metric): 1608; Case Code (Imperial): 0603; Material: Ceramic; Contact Plating: Tin; Min Operating Temperature: -55°C; Max Operating Temperature: 125°C; Tolerance: 10%; Package Quantity: 1; Packaging: Tape and Reel; Capacitance: 100nF; Dielectric: X7R; Series: CL; Voltage Rating: 50V; Voltage: 50V; Voltage Rating (DC): 50V; Construction: Flat; Length: 1.6mm; Width: 0.031inch; Height: 0.8mm; Depth: 0.8mm; Thickness: 0.035inch; Radiation Hardening: No; Lead Free: Lead Free; RoHS Compliant: Yes; ComponentLink1URL: https://datasheet.ciiva.com/25803/cl10b104kb8nnnc-25803393.pdf?src-supplier=Digi-Key; ComponentLink1Description: https://datasheet.ciiva.com/25803/cl10b104kb8nnnc-25803393.pdf?src-supplier=Digi-Key; ComponentLink2URL: https://datasheet.ciiva.com/26838/getdatasheetpartid-89097-26838411.pdf?src-supplier=Verical; ComponentLink2Description: https://datasheet.ciiva.com/26838/getdatasheetpartid-89097-26838411.pdf?src-supplier=Verical; ComponentLink3URL: https://datasheet.ciiva.com/29198/456651-da-01-en-vs-kondensator-0605-29198839.pdf?src-supplier=Conrad; ComponentLink3Description: https://datasheet.ciiva.com/29198/456651-da-01-en-vs-kondensator-0605-29198839.pdf?src-supplier=Conrad; Supplier Part Number 1: 1276-1000-1-ND
C15 = Cap 0603 10nF 10% 50V: CAP CER 10000PF 50V X7R 0603; Manufacturer: Samsung; Manufacturer Part Number: CL10B103KB8NFNC; Tolerance: 10%; Supplier 1: Digi-Key; RoHS: Yes; Category: Ceramic Capacitors; Stock 1: 172215; Pricing 1: 1=0.10000, 10=0.03700, 50=0.02020, 100=0.01650, 500=0.01176, 1000=0.00923 (USD); Mount: Surface Mount; Case/Package: 0603; Case Code (Metric): 1608; Case Code (Imperial): 0603; Contact Plating: Tin,Matte; Min Operating Temperature: -55°C; Max Operating Temperature: 125°C; Capacitance: 10nF; Dielectric: X7R; Voltage Rating: 50V; Packaging: Tape and Reel; Series: CL; Construction: Flat; Length: 0.063inch; Width: 0.031inch; Height: 0.8mm; Depth: 0.8mm; Thickness: 0.035inch; Radiation Hardening: No; ComponentLink1URL: https://datasheet.ciiva.com/25712/cl10b103kb8nfnc-25712209.pdf?src-supplier=Digi-Key; ComponentLink1Description: https://datasheet.ciiva.com/25712/cl10b103kb8nfnc-25712209.pdf?src-supplier=Digi-Key; Supplier Part Number 1: 1276-1922-1-ND; RoHS Compliant: Yes
C18 = Cap 0603 10uF 10% 25V: 0603 10 uF 25 V ±20 % Tolerance X5R Surface Mount Multilayer Ceramic Capacitor; Manufacturer: Murata; Manufacturer Part Number: GRT188R61E106ME13D; Voltage Rating: 25V; Tolerance: 20%; Supplier 1: Digi-Key; RoHS: No; Category: Ceramic Capacitors; Stock 1: 290939; Pricing 1: 1=0.53000, 10=0.36700, 50=0.25660, 100=0.22000, 500=0.16498, 1000=0.13932 (USD); Case/Package: 0603; RoHS Compliant: No; ComponentLink1URL: https://search.murata.co.jp/Ceramy/image/img/A01X/G101/ENG/GRT188R61E106ME13-01.pdf?src-supplier=Digi-Key; ComponentLink1Description: https://search.murata.co.jp/Ceramy/image/img/A01X/G101/ENG/GRT188R61E106ME13-01.pdf?src-supplier=Digi-Key; Supplier Part Number 1: 490-12323-1-ND; Mount: Surface Mount; Case Code (Metric): 1608; Case Code (Imperial): 0603; Min Operating Temperature: -55°C; Max Operating Temperature: 85°C; Packaging: Tape and Reel; Capacitance: 10uF; Length: 0.063inch; Width: 0.031inch; Thickness: 0.035inch; Ratings: AEC-Q200; ComponentLink2URL: http://search.murata.co.jp/Ceramy/image/img/A01X/G101/ENG/GRT188R61E106ME13-01.pdf?src-supplier=Digi-Key; ComponentLink2Description: http://search.murata.co.jp/Ceramy/image/img/A01X/G101/ENG/GRT188R61E106ME13-01.pdf?src-supplier=Digi-Key
R38 = Res 0603 10K 1%: as R32 on sheet EIT_Teensy_Teensy3.6; Supplier 1: Digi-Key; RoHS: Yes; Category: Chip SMD Resistors; Stock 1: 18430741; Pricing 1: 1=0.10000, 10=0.02400, 100=0.00970, 1000=0.00436, 2500=0.00378 (USD); Case/Package: 0603; Number of Pins: 2; Case Code (Imperial): 0603; Case Code (Metric): 1608; Size Code: 0603; Weight: 7.1E-05oz; Min Operating Temperature: -55°C; Max Operating Temperature: 155°C; Packaging: Tape and Reel; Tolerance: 1%; Termination: SMD/SMT; Resistor Type: Thick Film; Temperature Coefficient: 100ppm/°C; Features: Moisture Resistant; Series: RC; Max Power Dissipation: 100mW; Number of Terminations: 2; Resistance Tolerance: 1%; Construction: Rectangular; Length: 1.6mm; Width: 0.8mm; Height: 0.45mm; Depth: 0.8mm; Lead Pitch: 0.3mm; REACH SVHC: Unknown; Military Standard: Not; Lead Free: Lead Free; RoHS Compliant: Yes; ComponentLink1URL: https://datasheet.ciiva.com/15189/getdatasheetpartid-409289-15189591.pdf?src-supplier=Verical; ComponentLink1Description: https://datasheet.ciiva.com/15189/getdatasheetpartid-409289-15189591.pdf?src-supplier=Verical; ComponentLink2URL: https://datasheet.ciiva.com/7660/38590-7660789.pdf?src-supplier=Element14; ComponentLink2Description: https://datasheet.ciiva.com/7660/38590-7660789.pdf?src-supplier=Element14; ComponentLink3URL: https://datasheet.ciiva.com/7746/1738695-7746239.pdf?src-supplier=Element14; ComponentLink3Description: https://datasheet.ciiva.com/7746/1738695-7746239.pdf?src-supplier=Element14; ComponentLink4URL: https://datasheet.ciiva.com/7983/443971-7983596.pdf?src-supplier=Element14; ComponentLink4Description: https://datasheet.ciiva.com/7983/443971-7983596.pdf?src-supplier=Element14; ComponentLink5URL: https://datasheet.ciiva.com/22747/443971-22747519.pdf?src-supplier=Element14; ComponentLink5Description: https://datasheet.ciiva.com/22747/443971-22747519.pdf?src-supplier=Element14; ComponentLink6URL: https://datasheet.ciiva.com/46440/1868787-46440891.pdf?src-supplier=Element14; ComponentLink6Description: https://datasheet.ciiva.com/46440/1868787-46440891.pdf?src-supplier=Element14; Supplier Part Number 1: 311-10.0KHRCT-ND
U17 = AD9833BRMZ: Direct Digital Synthesizer 25MHz 1-DAC 10-Bit Serial 10-Pin MSOP T/R; Manufacturer: Analog Devices; Manufacturer Part Number: AD9833BRMZ-REEL; Min Supply Voltage: 2.3V; Max Supply Voltage: 5.5V; Resolution: 10b; Number of Converters: 1; Signal to Noise Ratio (SNR): 60dB; Power Dissipation: 27.5mW; Nominal Supply Current: 5.5mA; Number of Bits: 10; Nominal Output Voltage: 650mV; Output Type: Voltage; Supplier 1: Digi-Key; RoHS: Yes; Category: Integrated Circuits (ICs); Stock 1: 963; Pricing 1: 1=10.65000, 10=9.61700, 25=9.17000, 100=7.96230, 250=7.60444, 500=6.93346, 1000=6.33000 (USD); Mount: Surface Mount; Case/Package: MSOP; Number of Pins: 10; Contact Plating: Tin,Matte; Min Operating Temperature: -40°C; Max Operating Temperature: 105°C; Packaging: Tape and Reel; Package Quantity: 3000; Number of Outputs: 1; Number of D/A Converters: 1; Max Supply Current: 5.5mA; Frequency: 25MHz; Operating Supply Current: 5.5mA; Series: -; Lead Free: Contains Lead; RoHS Compliant: Yes; ComponentLink1URL: https://datasheet.ciiva.com/26828/ad9833brmz-reel-26828130.pdf?src-supplier=IIIC; ComponentLink1Description: https://datasheet.ciiva.com/26828/ad9833brmz-reel-26828130.pdf?src-supplier=IIIC; ComponentLink2URL: https://datasheet.ciiva.com/3177/ad9833-3177366.pdf?src-supplier=Avnet; ComponentLink2Description: https://datasheet.ciiva.com/3177/ad9833-3177366.pdf?src-supplier=Avnet; ComponentLink3URL: https://datasheet.ciiva.com/25889/ad9833-25889575.pdf?src-supplier=Avnet+Europe; ComponentLink3Description: https://datasheet.ciiva.com/25889/ad9833-25889575.pdf?src-supplier=Avnet+Europe; Supplier Part Number 1: AD9833BRMZ-REELCT-ND
Y1 = XTAL 16MHz 5V SMD: CRYSTAL, 16MHZ, 18PF, 5 X 3.2MM; Product Range:ABM3B Series; Frequency Nom:16MHz; Frequency Stability + / -:50ppm; Frequency Tolerance + / -:20ppm; Crystal Case:SMD, 5mm x 3.2mm; Load Capacitance:18pF; Operating Temperature Min:-20 C;RoHS Compliant: Yes; Manufacturer: Abracon; Manufacturer Part Number: ABM3B-16.000MHZ-B2-T; ESR (Equivalent Series Resistance): 50R; Tolerance: 20ppm; Frequency Stability: 50ppm; Supplier 1: Digi-Key; RoHS: Yes; Category: Crystals; Stock 1: 37377; Pricing 1: 1=0.95000, 10=0.83900, 50=0.78440, 100=0.69310, 500=0.65664 (USD); Mount: Surface Mount; Case/Package: CSMD; Number of Pins: 4; Min Operating Temperature: -20°C; Max Operating Temperature: 70°C; Frequency: 16MHz; Load Capacitance: 18pF; Packaging: Tape and Reel; Package Quantity: 1000; Frequency Tolerance: 20ppm; Termination: SMD/SMT; Resistor Type: Ceramic; Accuracy: 20ppm; Series: ABM3B; Operating Frequency: 16 MHz; Length: 5mm; Width: 3.2mm; Height: 0.043inch; Depth: 3.2mm; REACH SVHC: No SVHC; Lead Free: Lead Free; ComponentLink1URL: https://datasheet.ciiva.com/855/abm3b-855719.pdf?src-supplier=Digi-Key; ComponentLink1Description: https://datasheet.ciiva.com/855/abm3b-855719.pdf?src-supplier=Digi-Key; ComponentLink2URL: https://datasheet.ciiva.com/855/abm3b-855720.pdf?src-supplier=Digi-Key; ComponentLink2Description: https://datasheet.ciiva.com/855/abm3b-855720.pdf?src-supplier=Digi-Key; ComponentLink3URL: https://datasheet.ciiva.com/855/abm3b-855721.pdf?src-supplier=Digi-Key; ComponentLink3Description: https://datasheet.ciiva.com/855/abm3b-855721.pdf?src-supplier=Digi-Key; ComponentLink4URL: https://datasheet.ciiva.com/3175/abm3b-3175822.pdf?src-supplier=Avnet; ComponentLink4Description: https://datasheet.ciiva.com/3175/abm3b-3175822.pdf?src-supplier=Avnet; ComponentLink5URL: https://datasheet.ciiva.com/16410/abm3b-16410983.pdf?src-supplier=Future+Electronics; ComponentLink5Description: https://datasheet.ciiva.com/16410/abm3b-16410983.pdf?src-supplier=Future+Electronics; ComponentLink6URL: https://datasheet.ciiva.com/7998/1883675-7998599.pdf?src-supplier=Element14; ComponentLink6Description: https://datasheet.ciiva.com/7998/1883675-7998599.pdf?src-supplier=Element14; Supplier Part Number 1: 535-9122-1-ND

## Sheet EIT_Teensy_Connections.SchDoc: EIT_Teensy
size A4
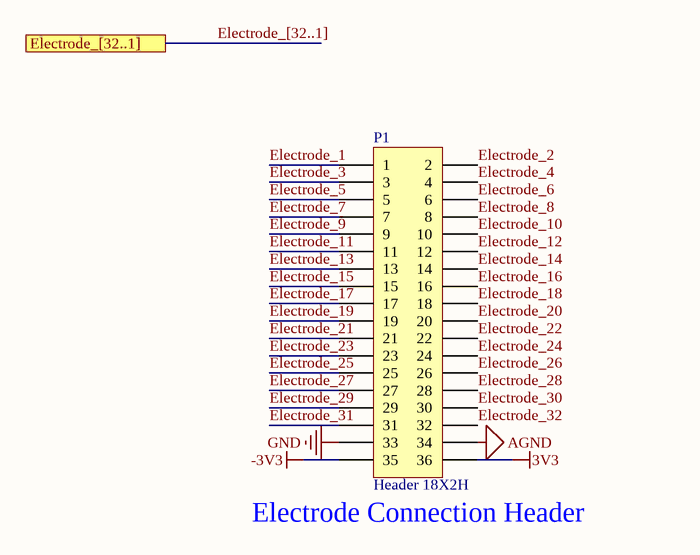
[diagram p3: EIT_Teensy_Connections.SchDoc]

### Parts
P1  Header 18X2H  [HDR2X18H]

### Ports
Electrode_[32..1]

### Nets
3V3: P1.36
-3V3: P1.35
AGND: P1.34
GND: P1.33
Electrode_1: P1.1
Electrode_2: P1.2
Electrode_3: P1.3
Electrode_4: P1.4
Electrode_5: P1.5
Electrode_6: P1.6
Electrode_7: P1.7
Electrode_8: P1.8
Electrode_9: P1.9
Electrode_10: P1.10
Electrode_11: P1.11
Electrode_12: P1.12
Electrode_13: P1.13
Electrode_14: P1.14
Electrode_15: P1.15
Electrode_16: P1.16
Electrode_17: P1.17
Electrode_18: P1.18
Electrode_19: P1.19
Electrode_20: P1.20
Electrode_21: P1.21
Electrode_22: P1.22
Electrode_23: P1.23
Electrode_24: P1.24
Electrode_25: P1.25
Electrode_26: P1.26
Electrode_27: P1.27
Electrode_28: P1.28
Electrode_29: P1.29
Electrode_30: P1.30
Electrode_31: P1.31
Electrode_32: P1.32

### Buses and harness runs
bus Electrode_[32..1] = port Electrode_[32..1]

### Notes on the sheet
- (near P1) Electrode Connection Header

### Library data of the parts
P1 = Header 18X2 2.54mm T/H R/A Male: CONN HEADER .100 DUAL R/A 36POS; Manufacturer: Sullins; Manufacturer Part Number: PRPC018DBAN-M71RC; Number of Positions: 36; Connector Type: Male Pin; Pitch: 0.1inch; Supplier 1: Digi-Key; RoHS: Yes; Category: Connectors; Pricing 1: 1=1.38000, 10=1.25200, 25=1.17480, 50=1.12380, 100=1.07280, 250=0.97060, 500=0.89398 (USD); Mount: Through Hole; Color: Black; Contact Plating: Gold; Package Quantity: 1; Number of Rows: 2; Packaging: Bulk; Termination: Solder; Series: -; Contact Type: Male Pin; Row Spacing: 0.1inch; Contact Mating Length: 0.23inch; RoHS Compliant: Yes; ComponentLink1URL: https://datasheet.ciiva.com/741/xrxczzzdxxn-m71rc-11639-b-741667.pdf?src-supplier=Digi-Key; ComponentLink1Description: https://datasheet.ciiva.com/741/xrxczzzdxxn-m71rc-11639-b-741667.pdf?src-supplier=Digi-Key; Supplier Part Number 1: S2111EC-18-ND